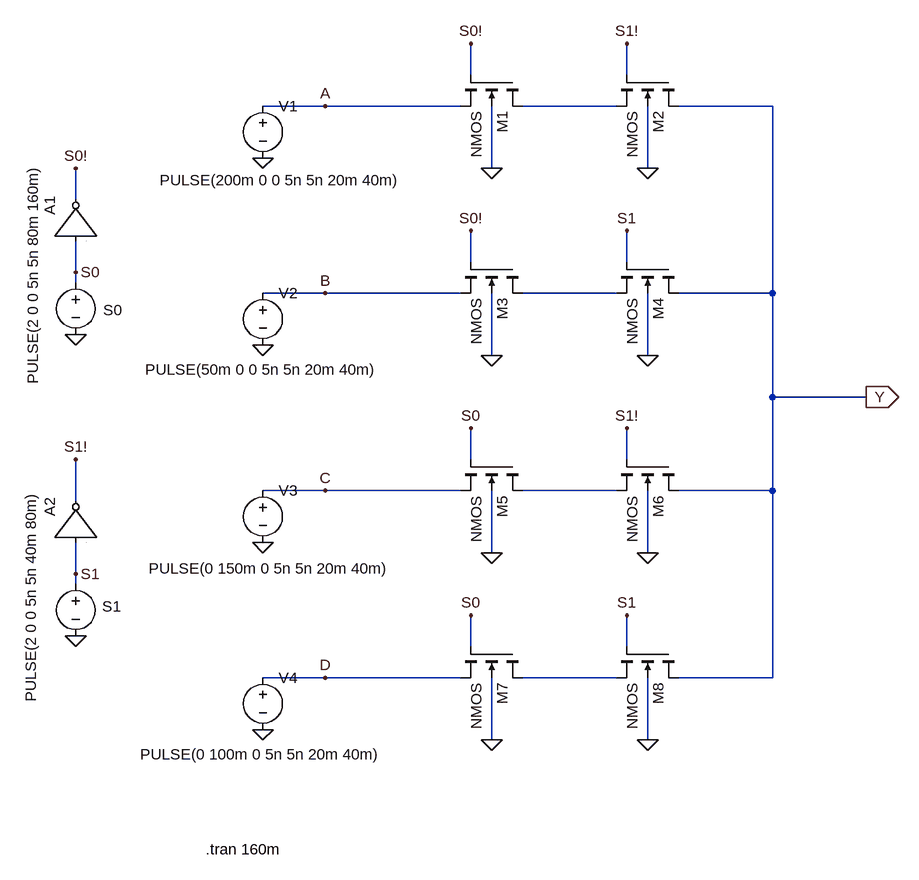
[diagram p0: schematic 4 to 1 mux 2.asc]
4 to 1 mux 2.asc, the LTspice schematic file:
Version 4.1
SHEET 1 1412 896
WIRE -96 -368 -96 -416
WIRE 144 -368 144 -416
WIRE -320 -320 -416 -320
WIRE -112 -320 -320 -320
WIRE 128 -320 -16 -320
WIRE 368 -320 224 -320
WIRE -64 -224 -64 -320
WIRE 176 -224 176 -320
WIRE -704 -176 -704 -224
WIRE -96 -80 -96 -128
WIRE 144 -80 144 -128
WIRE -704 -64 -704 -112
WIRE -704 -48 -704 -64
WIRE -320 -32 -416 -32
WIRE -112 -32 -320 -32
WIRE 128 -32 -16 -32
WIRE 368 -32 368 -320
WIRE 368 -32 224 -32
WIRE -64 64 -64 -32
WIRE 176 64 176 -32
WIRE 368 128 368 -32
WIRE 512 128 368 128
WIRE -96 224 -96 176
WIRE 144 224 144 176
WIRE -320 272 -416 272
WIRE -112 272 -320 272
WIRE 128 272 -16 272
WIRE 368 272 368 128
WIRE 368 272 224 272
WIRE -704 288 -704 224
WIRE -64 368 -64 272
WIRE 176 368 176 272
WIRE -704 400 -704 352
WIRE -704 416 -704 400
WIRE -96 512 -96 464
WIRE 144 512 144 464
WIRE -320 560 -416 560
WIRE -112 560 -320 560
WIRE 128 560 -16 560
WIRE 368 560 368 272
WIRE 368 560 224 560
WIRE -64 656 -64 560
WIRE 176 656 176 560
FLAG -416 640 0
FLAG -416 48 0
FLAG -416 352 0
FLAG -416 -240 0
FLAG -704 32 0
FLAG -704 496 0
FLAG -704 -64 S0
FLAG -704 400 S1
FLAG -320 -32 B
FLAG -320 272 C
FLAG -320 560 D
FLAG -320 -320 A
FLAG -704 -224 S0!
FLAG -96 -416 S0!
FLAG -96 176 S0
FLAG 144 -416 S1!
FLAG 144 -128 S1
FLAG -704 224 S1!
FLAG 144 176 S1!
FLAG 144 464 S1
FLAG -96 464 S0
FLAG -96 -128 S0!
FLAG -64 -224 0
FLAG 176 -224 0
FLAG -64 64 0
FLAG 176 64 0
FLAG -64 368 0
FLAG 176 368 0
FLAG -64 656 0
FLAG 176 656 0
FLAG 512 128 Y
IOPIN 512 128 Out
SYMBOL voltage -416 -336 R0
WINDOW 123 0 0 Left 0
WINDOW 39 0 0 Left 0
WINDOW 3 -159 130 Left 2
SYMATTR Value PULSE(200m 0 0 5n 5n 20m 40m)
SYMATTR InstName V1
SYMBOL voltage -416 -48 R0
WINDOW 123 0 0 Left 0
WINDOW 39 0 0 Left 0
WINDOW 3 -181 134 Left 2
SYMATTR Value PULSE(50m 0 0 5n 5n 20m 40m)
SYMATTR InstName V2
SYMBOL voltage -416 256 R0
WINDOW 123 0 0 Left 0
WINDOW 39 0 0 Left 0
WINDOW 3 -176 136 Left 2
SYMATTR Value PULSE(0 150m 0 5n 5n 20m 40m)
SYMATTR InstName V3
SYMBOL voltage -416 544 R0
WINDOW 3 -189 134 Left 2
WINDOW 123 0 0 Left 0
WINDOW 39 0 0 Left 0
SYMATTR Value PULSE(0 100m 0 5n 5n 20m 40m)
SYMATTR InstName V4
SYMBOL voltage -704 -64 R0
WINDOW 123 0 0 Left 0
WINDOW 39 0 0 Left 0
WINDOW 3 -66 -165 VRight 2
WINDOW 0 42 58 Left 2
SYMATTR Value PULSE(2 0 0 5n 5n 80m 160m)
SYMATTR InstName S0
SYMBOL voltage -704 400 R0
WINDOW 123 0 0 Left 0
WINDOW 39 0 0 Left 0
WINDOW 3 -69 -127 VRight 2
WINDOW 0 41 50 Left 2
SYMATTR Value PULSE(2 0 0 5n 5n 40m 80m)
SYMATTR InstName S1
SYMBOL nmos4 -16 -368 R90
SYMATTR InstName M1
SYMBOL nmos4 224 -368 R90
SYMATTR InstName M2
SYMBOL nmos4 -16 -80 R90
SYMATTR InstName M3
SYMBOL nmos4 224 -80 R90
SYMATTR InstName M4
SYMBOL nmos4 -16 224 R90
SYMATTR InstName M5
SYMBOL nmos4 224 224 R90
SYMATTR InstName M6
SYMBOL nmos4 -16 512 R90
SYMATTR InstName M7
SYMBOL nmos4 224 512 R90
SYMATTR InstName M8
SYMBOL Digital\\inv -768 -112 R270
SYMATTR InstName A1
SYMBOL Digital\\inv -768 352 R270
SYMATTR InstName A2
TEXT -504 824 Left 2 !.tran 160m

The netlist it stands for:
* 4 to 1 mux 2.asc
V1 A 0 PULSE(200m 0 0 5n 5n 20m 40m)
V2 B 0 PULSE(50m 0 0 5n 5n 20m 40m)
V3 C 0 PULSE(0 150m 0 5n 5n 20m 40m)
V4 D 0 PULSE(0 100m 0 5n 5n 20m 40m)
V§S0 S0 0 PULSE(2 0 0 5n 5n 80m 160m)
V§S1 S1 0 PULSE(2 0 0 5n 5n 40m 80m)
M1 N001 S0! A 0 NMOS
M2 Y S1! N001 0 NMOS
M3 N002 S0! B 0 NMOS
M4 Y S1 N002 0 NMOS
M5 N003 S0 C 0 NMOS
M6 Y S1! N003 0 NMOS
M7 N004 S0 D 0 NMOS
M8 Y S1 N004 0 NMOS
A1 S0 0 0 0 0 S0! 0 0 BUF
A2 S1 0 0 0 0 S1! 0 0 BUF
.model NMOS NMOS
.model PMOS PMOS
.lib standard.mos
.tran 160m
.backanno
.end